# EAGLE design CNC-Controller (EAGLE 6.1)
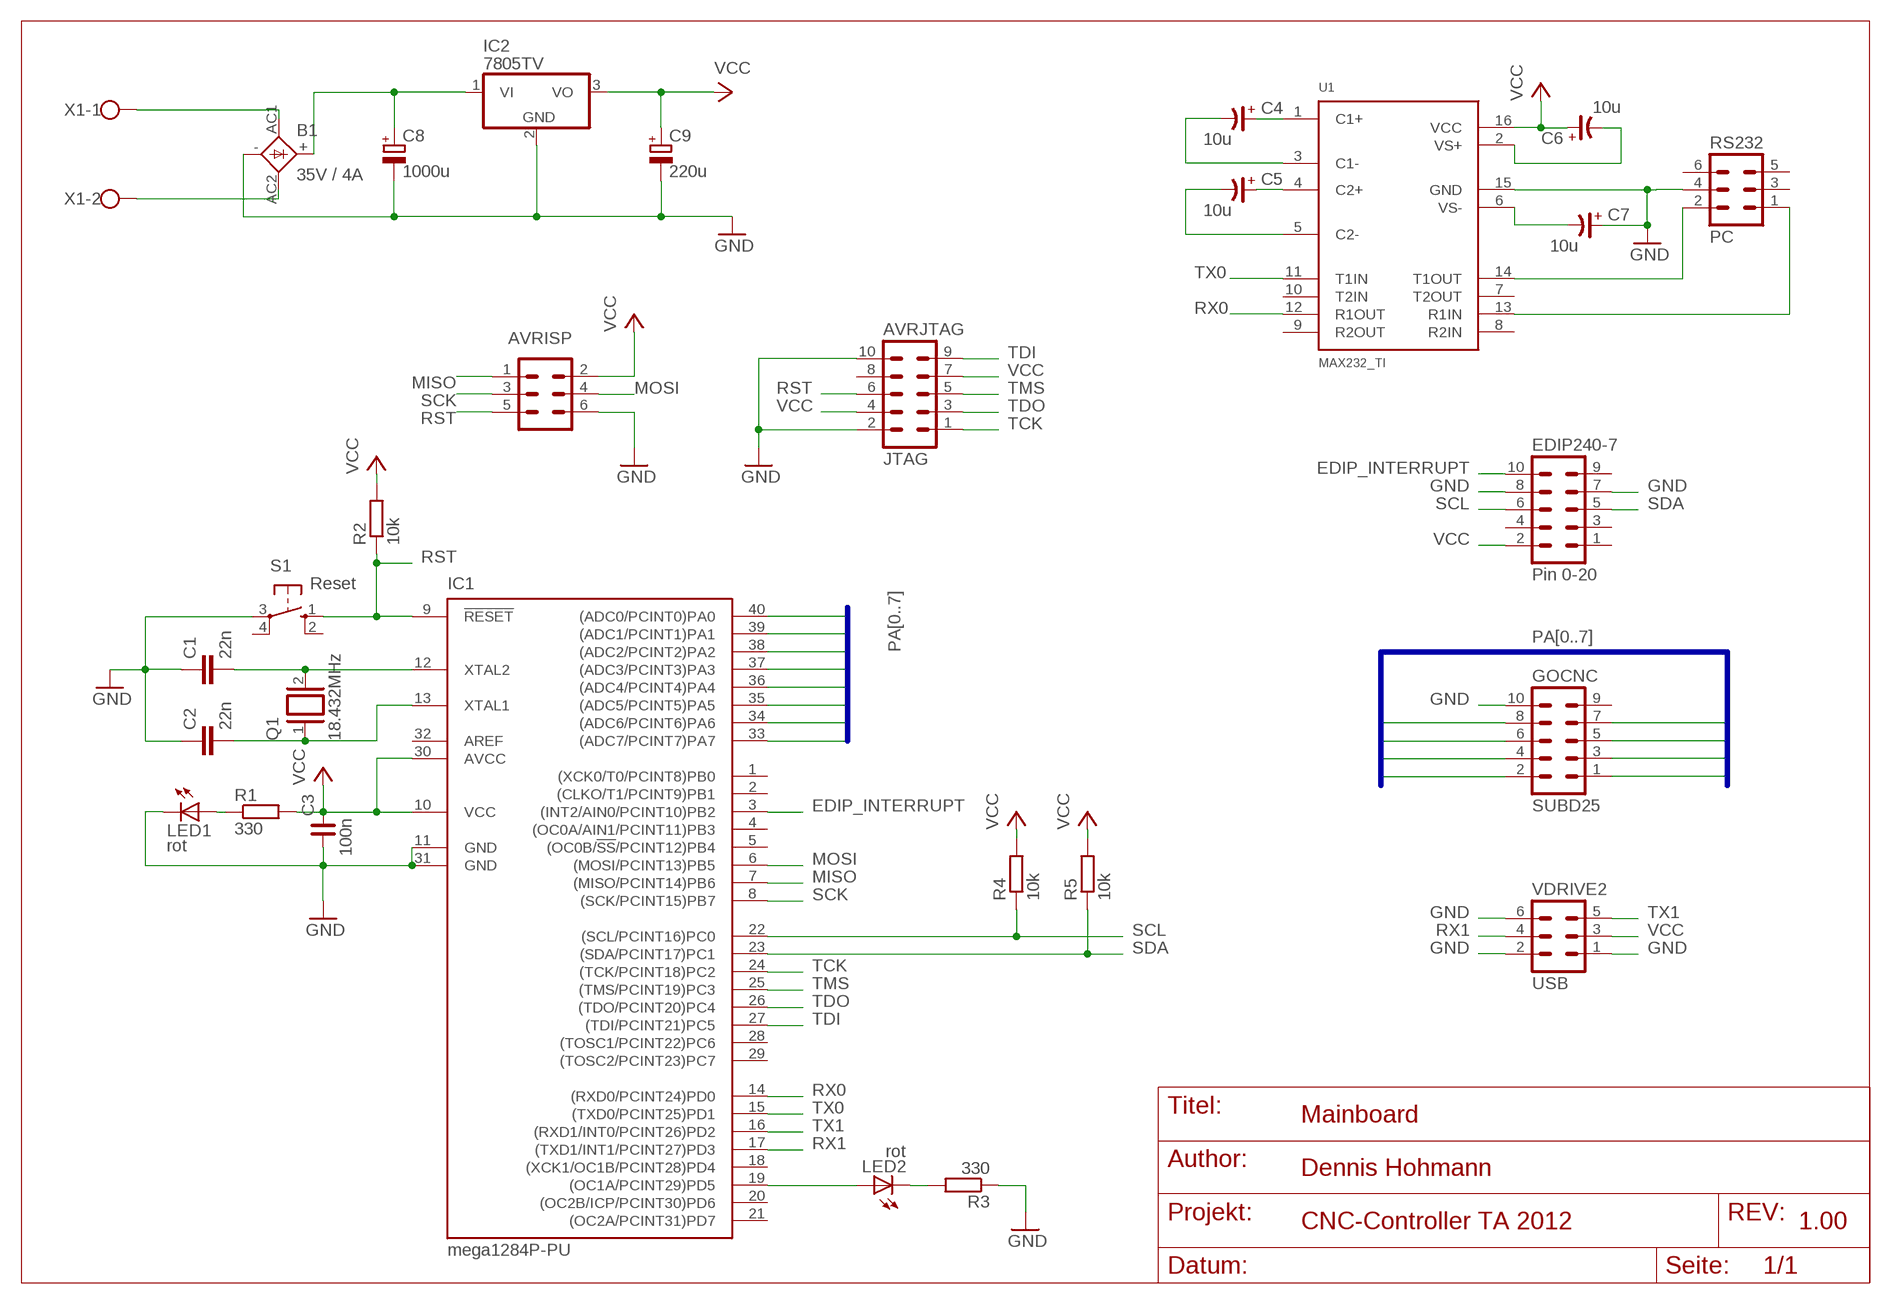
[diagram p0: schematic, sheet 1]

## Parts
AVRISP  ISP  ML6  [ML6]
AVRJTAG  JTAG  ML10  [ML10]
B1  35V / 4A  KBU  [KBU]
C1  22n  C-EU025-025X050  [C025-025X050]
C2  22n  C-EU025-025X050  [C025-025X050]
C3  100n  C_C025-050X025  [C025-050X025]
C4  10u  CP_TT025-050  [CTT-025-050]
C5  10u  CP_TT025-050  [CTT-025-050]
C6  10u  CP_TT025-050  [CTT-025-050]
C7  10u  CP_TT025-050  [CTT-025-050]
C8  1000u  CPOL-EUE5-13  [E5-13]
C9  220u  CPOL-EUE2-5  [E2-5]
EDIP240-7  Pin 0-20  ML10  [ML10]
GOCNC  SUBD25  ML10  [ML10]
IC1  mega1284P-PU  MEGA164P/324P/644P-PU  [DIL40]
IC2  7805TV  [TO220V]
LED1  rot  LED3MM  [LED3MM]
LED2  rot  LED3MM  [LED3MM]
Q1  18.432MHz  XTAL/S  [QS]
R1  330  R-EU_0207/10  [0207/10]
R2  10k  R-EU_0207/10  [0207/10]
R3  330  R-EU_0207/10  [0207/10]
R4  10k  R-EU_0207/10  [0207/10]
R5  10k  R-EU_0207/10  [0207/10]
RS232  PC  ML6  [ML6]
S1  Reset  10-XX  [B3F-10XX]
U1  MAX232_TI  [DIL16]
VDRIVE2  USB  ML6  [ML6]
X1  W237-102  [W237-102]

## Nets
EDIP_INTERRUPT: EDIP240-7.10 IC1.3((INT2/AIN0/PCINT10)PB2)
GND: AVRISP.6 AVRJTAG.2 AVRJTAG.10 B1.- C1.1 C2.1 C3.1 C7.+ C8.- C9.- EDIP240-7.7 EDIP240-7.8 GOCNC.10 IC1.11(GND) IC1.31(GND) IC2.2(GND) LED1.K(C) R3.1 RS232.4 S1.3(P) U1.15(GND) VDRIVE2.1 VDRIVE2.2 VDRIVE2.6
MISO: AVRISP.1 IC1.7((MISO/PCINT14)PB6)
MOSI: AVRISP.4 IC1.6((MOSI/PCINT13)PB5)
N$1: C1.2 IC1.12(XTAL2) Q1.2
N$2: C4.+ U1.1(C1+)
N$3: LED1.A R1.1
N$4: C4.- U1.3(C1-)
N$5: C2.2 IC1.13(XTAL1) Q1.1
N$6: C5.+ U1.4(C2+)
N$7: C5.- U1.5(C2-)
N$8: C6.- U1.2(VS+)
N$10: RS232.2 U1.14(T1OUT)
N$11: RS232.1 U1.13(R1IN)
N$12: C7.- U1.6(VS-)
N$13: IC1.19((OC1A/PCINT29)PD5) LED2.A
N$16: LED2.K(C) R3.2
PA0: GOCNC.1 IC1.40((ADC0/PCINT0)PA0)
PA1: GOCNC.2 IC1.39((ADC1/PCINT1)PA1)
PA2: GOCNC.3 IC1.38((ADC2/PCINT2)PA2)
PA3: GOCNC.4 IC1.37((ADC3/PCINT3)PA3)
PA4: GOCNC.5 IC1.36((ADC4/PCINT4)PA4)
PA5: GOCNC.6 IC1.35((ADC5/PCINT5)PA5)
PA6: GOCNC.7 IC1.34((ADC6/PCINT6)PA6)
PA7: GOCNC.8 IC1.33((ADC7/PCINT7)PA7)
RST: AVRISP.5 AVRJTAG.6 IC1.9(!RESET) R2.1 S1.1(S)
RX0: IC1.14((RXD0/PCINT24)PD0) U1.12(R1OUT)
RX1: IC1.17((TXD1/INT1/PCINT27)PD3) VDRIVE2.4
SCK: AVRISP.3 IC1.8((SCK/PCINT15)PB7)
SCL: EDIP240-7.6 IC1.22((SCL/PCINT16)PC0) R4.1
SDA: EDIP240-7.5 IC1.23((SDA/PCINT17)PC1) R5.1
TCK: AVRJTAG.1 IC1.24((TCK/PCINT18)PC2)
TDI: AVRJTAG.9 IC1.27((TDI/PCINT21)PC5)
TDO: AVRJTAG.3 IC1.26((TDO/PCINT20)PC4)
TMS: AVRJTAG.5 IC1.25((TMS/PCINT19)PC3)
TX0: IC1.15((TXD0/PCINT25)PD1) U1.11(T1IN)
TX1: IC1.16((RXD1/INT0/PCINT26)PD2) VDRIVE2.5
U+ [Leistung]: B1.+ C8.+ IC2.1(VI)
UB+ [Leistung]: B1.AC1 X1.1
UB- [Leistung]: B1.AC2 X1.2
VCC: AVRISP.2 AVRJTAG.4 AVRJTAG.7 C3.2 C6.+ C9.+ EDIP240-7.2 IC1.10(VCC) IC1.30(AVCC) IC2.3(VO) R1.2 R2.2 R4.2 R5.2 U1.16(VCC) VDRIVE2.3
Unconnected: AVRJTAG.8 EDIP240-7.1 EDIP240-7.3 EDIP240-7.4 EDIP240-7.9 GOCNC.9 IC1.1((XCK0/T0/PCINT8)PB0) IC1.2((CLKO/T1/PCINT9)PB1) IC1.4((OC0A/AIN1/PCINT11)PB3) IC1.5((OC0B/!SS!/PCINT12)PB4) IC1.18((XCK1/OC1B/PCINT28)PD4) IC1.20((OC2B/ICP/PCINT30)PD6) IC1.21((OC2A/PCINT31)PD7) IC1.28((TOSC1/PCINT22)PC6) IC1.29((TOSC2/PCINT23)PC7) RS232.3 RS232.5 RS232.6 S1.2(S1) S1.4(P1) U1.7(T2OUT) U1.8(R2IN) U1.9(R2OUT) U1.10(T2IN)

## Buses
PA[0..7]

## Notes on the sheet
- Mainboard
- Dennis Hohmann
- CNC-Controller TA 2012 | 1.00

## Power pins joined to a net without a drawn wire
AREF: IC1.32(AREF)

## Library data of the parts
AVRISP RS232 VDRIVE2 = con-harting-ml:ML6: HARTING
AVRJTAG EDIP240-7 GOCNC = con-harting-ml:ML10: HARTING
B1 = rectifier:KBU: DIOTEC RECTIFIER
C1 C2 = rcl:C-EU: CAPACITOR, European symbol
C3 = rc-master:C_: NON-POLARIZED CAP
C4-C7 = rc-master:CP_: POLARIZED CAP
C8 C9 = rcl:CPOL-EU: POLARIZED CAPACITOR, European symbol
IC1 = avr-5:MEGA164P/324P/644P-PU
IC2 = linear:78*: Positive VOLTAGE REGULATOR Source: http://cache.national.com/ds/LM/LM78L05.pdf http://www.fairchildsemi.com/ds/LM/LM7805.pdf
LED1 LED2 = led:LED: LED OSRAM: - CHIPLED LG R971, LG N971, LY N971, LG Q971, LY Q971, LO R971, LY R971 LH N974, LH R974 LS Q976, LO Q976, LY Q976 LO Q996 - Hyper CHIPLED LW Q18S LB Q993, LB Q99A, LB R99A - SideLED LS A670, LO A670, LY A670, LG A670, LP A670 LB A673, LV A673, LT A673, LW A673 LH A674 LY A675 LS A676, LA A676, LO A676, LY A676, LW A676 LS A679, LY A679, LG A679 - Hyper Micro SIDELED® LS Y876, LA Y876, LO Y876, LY Y876 LT Y87S - SmartLED LW L88C, LW L88S LB L89C, LB L89S, LG L890 LS L89K, LO L89K, LY L89K LS L896, LA L896, LO L896, LY L896 - TOPLED LS T670, LO T670, LY T670, LG T670, LP T670 LSG T670, LSP T670, LSY T670, LOP T670, LYG T670 LG T671, LOG T671, LSG T671 LB T673, LV T673, LT T673, LW T673 LH T674 LS T676, LA T676, LO T676, LY T676, LB T676, LH T676, LSB T676, LW T676 LB T67C, LV T67C, LT T67C, LS T67K, LO T67K, LY T67K, LW E67C LS E67B, LA E67B, LO E67B, LY E67B, LB E67C, LV E67C, LT E67C LW T67C LS T679, LY T679, LG T679 LS T770, LO T770, LY T770, LG T770, LP T770 LB T773, LV T773, LT T773, LW T773 LH T774 LS E675, LA E675, LY E675, LS T675 LS T776, LA T776, LO T776, LY T776, LB T776 LHGB T686 LT T68C, LB T68C - Hyper Mini TOPLED® LB M676 - Mini TOPLED Santana® LG M470 LS M47K, LO M47K, LY M47K Source: http://www.osram.convergy.de LUXEON: - LUMILED® LXK2-PW12-R00, LXK2-PW12-S00, LXK2-PW14-U00, LXK2-PW14-V00 LXK2-PM12-R00, LXK2-PM12-S00, LXK2-PM14-U00 LXK2-PE12-Q00, LXK2-PE12-R00, LXK2-PE12-S00, LXK2-PE14-T00, LXK2-PE14-U00 LXK2-PB12-K00, LXK2-PB12-L00, LXK2-PB12-M00, LXK2-PB14-N00, LXK2-PB14-P00, LXK2-PB14-Q00 LXK2-PR12-L00, LXK2-PR12-M00, LXK2-PR14-Q00, LXK2-PR14-R00 LXK2-PD12-Q00, LXK2-PD12-R00, LXK2-PD12-S00 LXK2-PH12-R00, LXK2-PH12-S00 LXK2-PL12-P00, LXK2-PL12-Q00, LXK2-PL12-R00 Source: www.luxeon.com KINGBRIGHT: KA-3528ASYC Source: www.kingbright.com
Q1 = special:XTAL/S: CRYSTAL
R1-R5 = resistor:R-EU_: RESISTOR, European symbol
S1 = switch-omron:10-XX: OMRON SWITCH
U1 = max232ti:MAX232_TI: MAX232, Texas Instruments Version
X1 = con-wago-500:W237-102: WAGO SCREW CLAMP; MPN: 237-102; OC_FARNELL: unknown; OC_NEWARK: 70K9898

## Net classes
1 Leistung: width 0.254 mm, clearance 0.305 mm

## Board
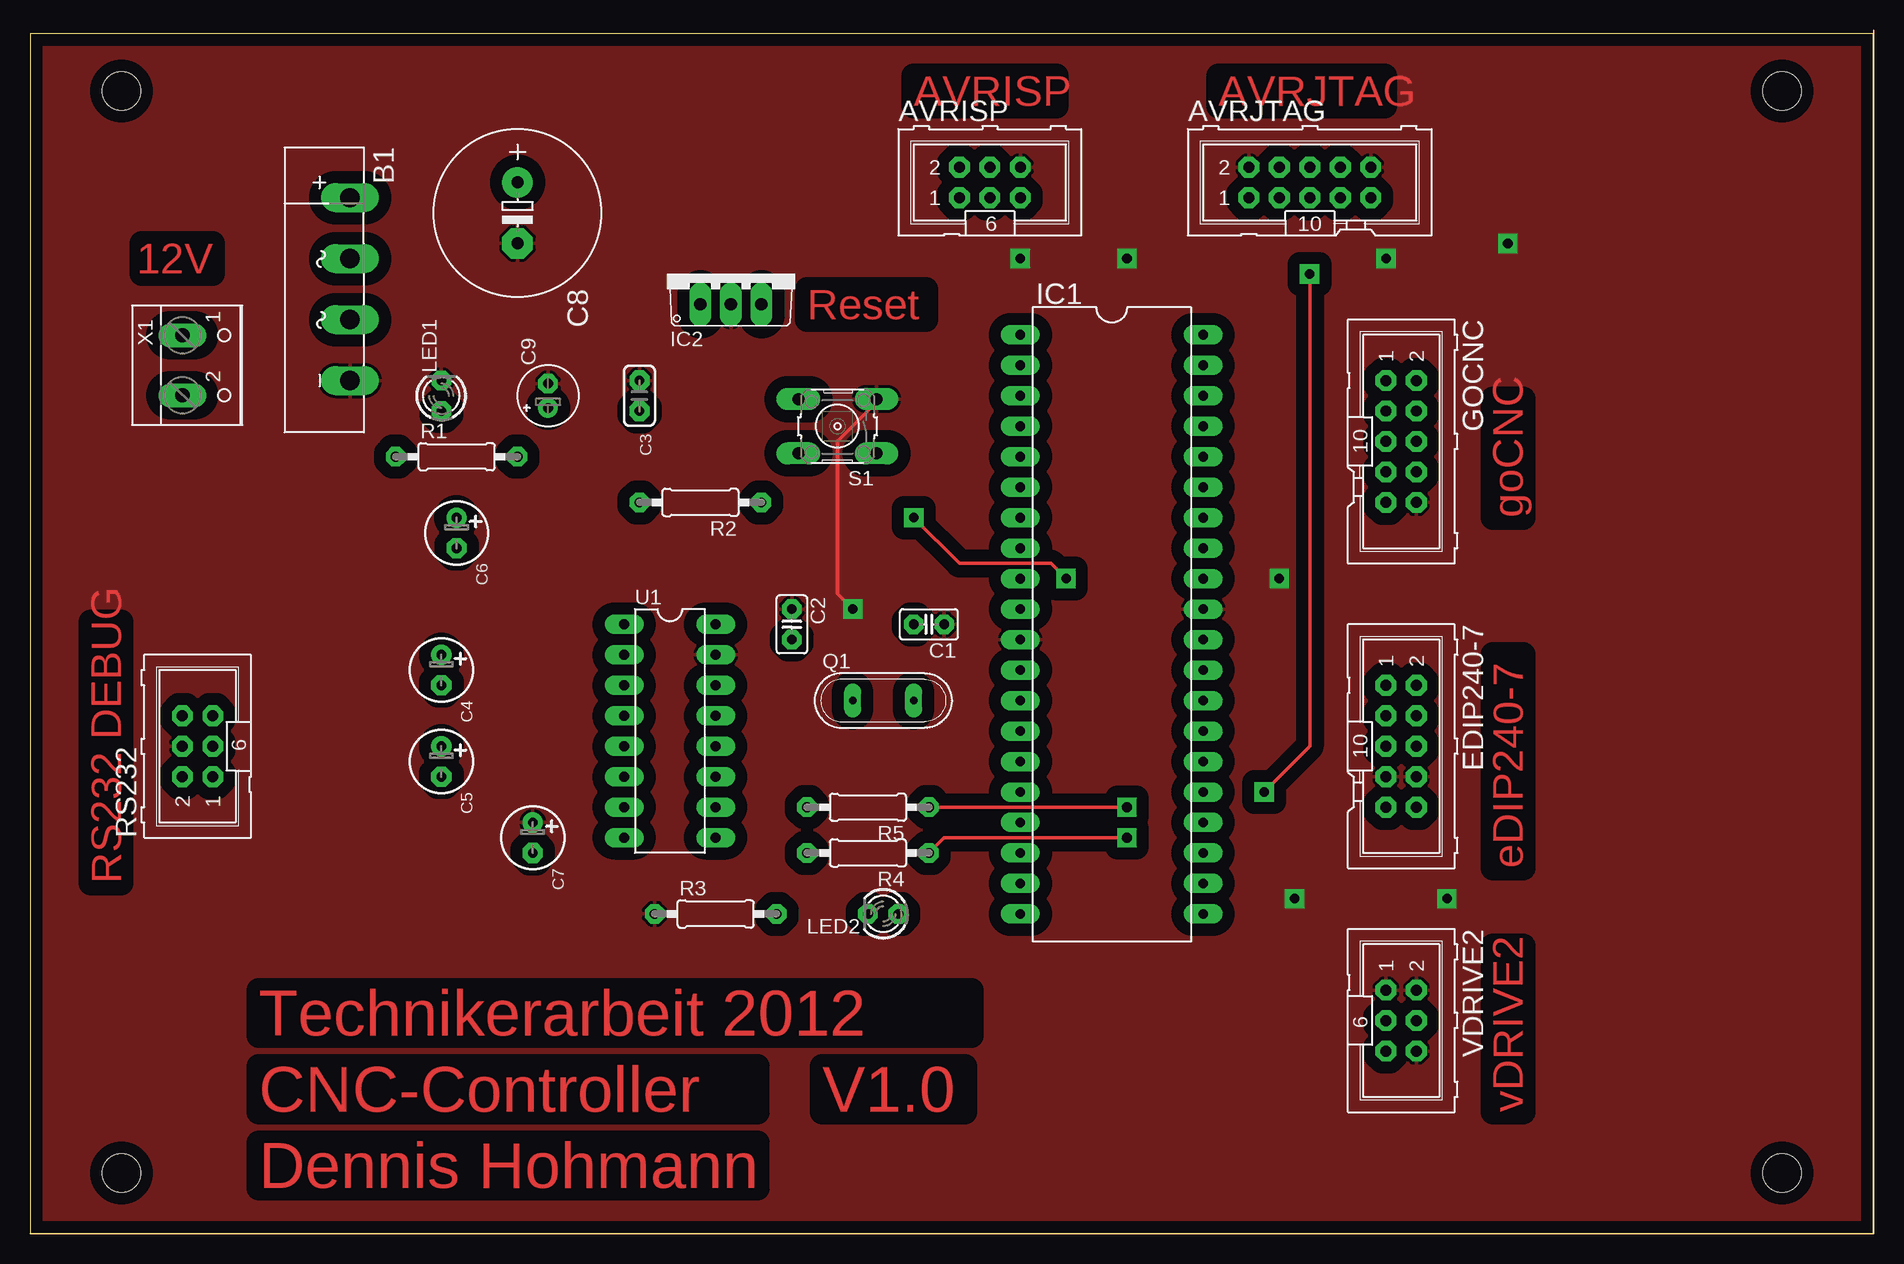
[diagram p1: board, top side]
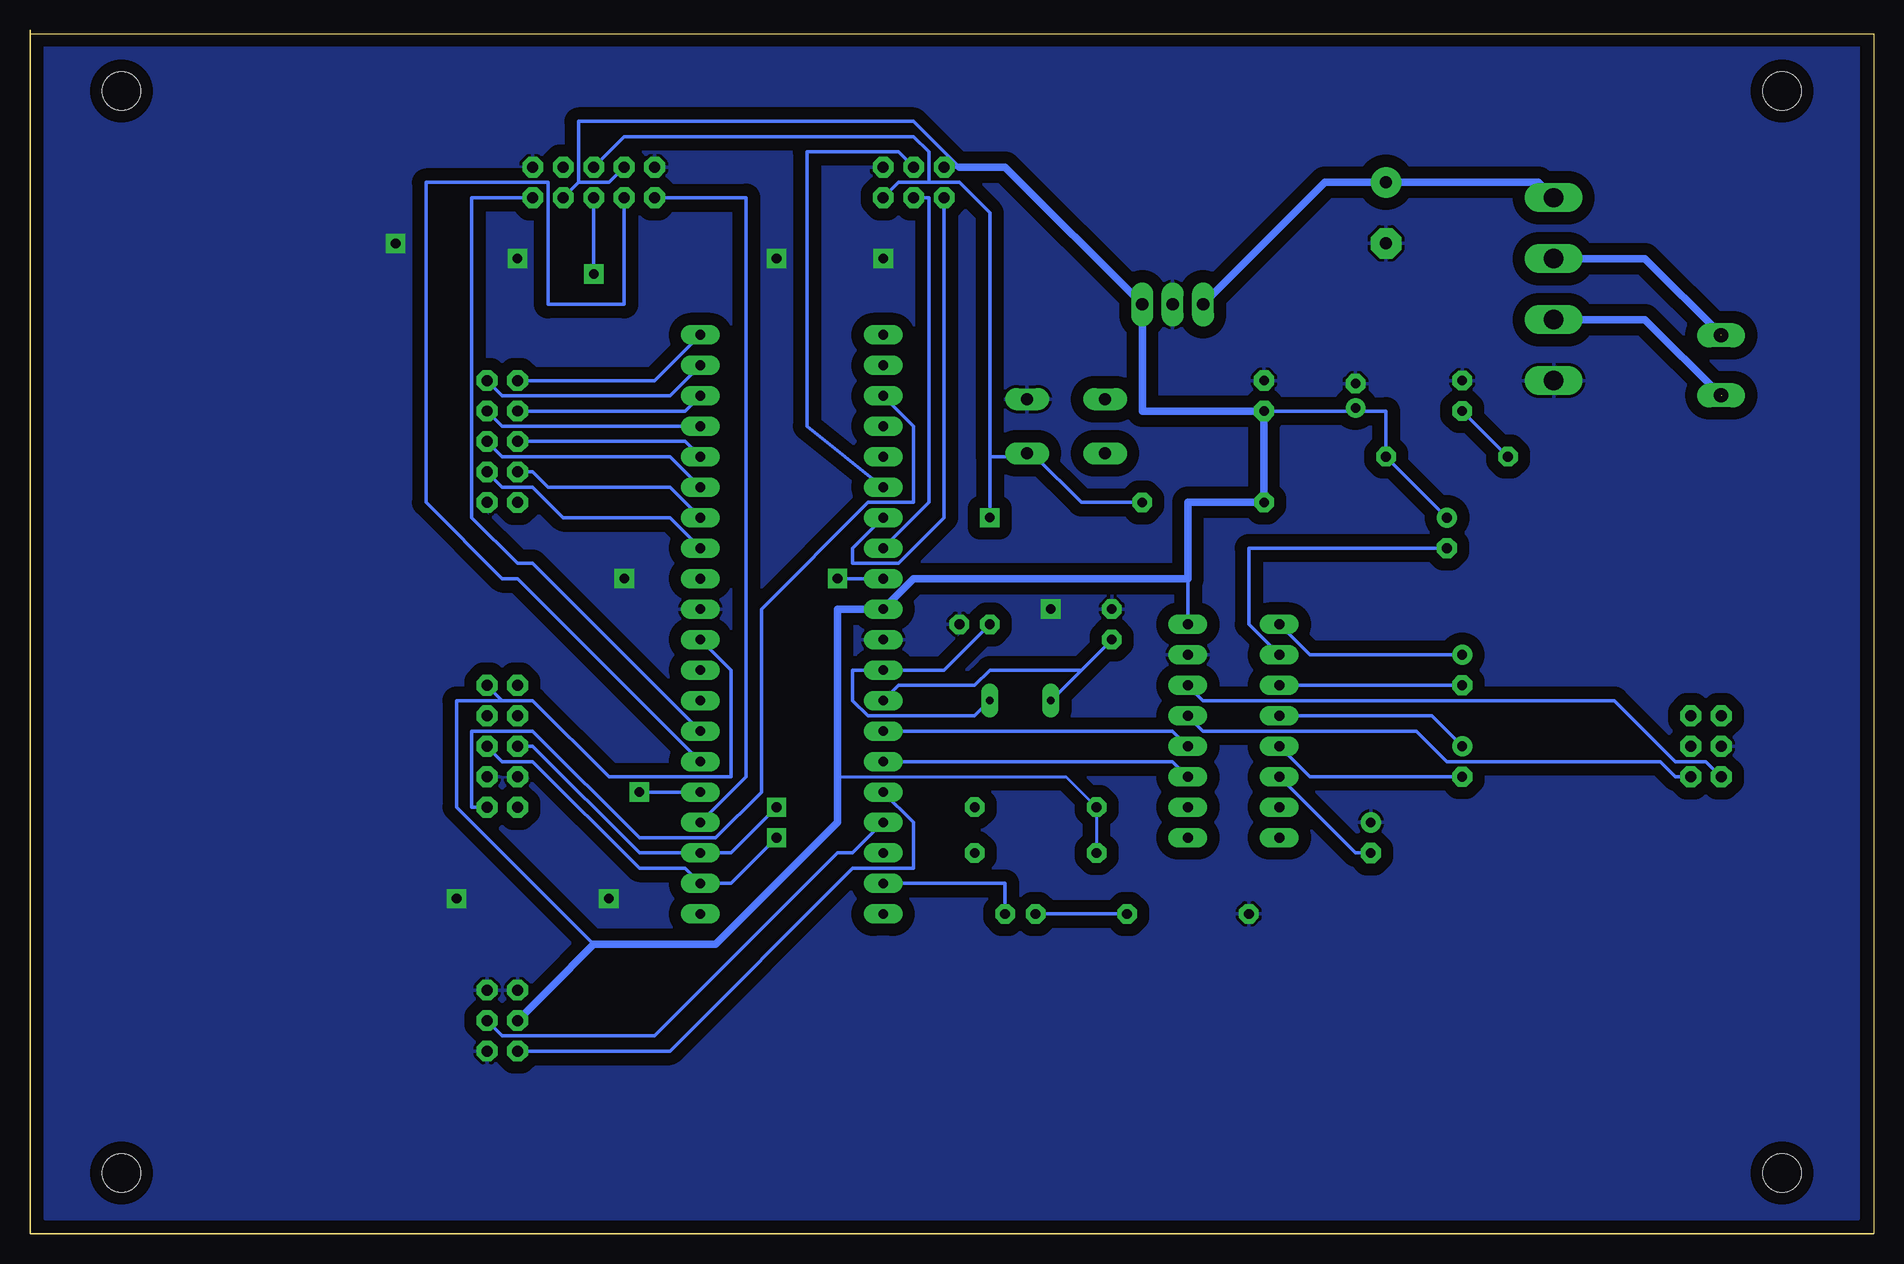
[diagram p2: board, bottom side, seen from below]

Size 153.65 x 100 mm. Coordinates in mm from the lower left corner, seen from the top.
Outline: 0,0 153.65,0 153.65,100 0,100 0,0
Copper layers (1*16): Top 0.035mm / dielectric 1.5mm / Bottom 0.035mm
Design rules: minimum track width 10mil, minimum drill 24mil, track to track 8mil, track to pad 8mil, pad to pad 8mil, via to via 8mil, smd to smd 8mil, copper to edge 40mil, drill to drill 8mil, minimum pad ring 16mil, minimum via ring 16mil, stop-mask expansion 4mil, vias tented up to drill 0mil, thermal gap 10mil
Holes 3.2 mm at 7.62,5.08 7.62,95.25 146.05,5.08 146.05,95.25

### Footprints (pad centres in the part's own frame; a part is rotated, then mirrored left to right if it is on the bottom)
ML6 = drill 0.914 octagon: 1 -2.54,-1.27; 2 -2.54,1.27; 3 0,-1.27; 4 0,1.27; 5 2.54,-1.27; 6 2.54,1.27
ML10 = drill 0.914 octagon: 1 -5.08,-1.27; 2 -5.08,1.27; 3 -2.54,-1.27; 4 -2.54,1.27; 5 0,-1.27; 6 0,1.27; 7 2.54,-1.27; 8 2.54,1.27; 9 5.08,-1.27; 10 5.08,1.27
KBU = drill 1.6 long: + -7.62,2.54; - 7.62,2.54; AC1 -2.54,2.54; AC2 2.54,2.54
C025-025X050 = drill 0.813 octagon: 1 -1.27,0; 2 1.27,0
C025-050X025 = drill 0.813 pad 1.676 octagon: 1 -1.27,0; 2 1.27,0
CTT-025-050 = drill 0.813 pad 1.676: + -1.27,0 | drill 0.813 pad 1.676 octagon: - 1.27,0
E5-13 = drill 1.016 pad 2.54: + -2.54,0 | drill 1.016 pad 2.54 octagon: - 2.54,0
E2-5 = drill 0.813 pad 1.27: + -1.016,0 | drill 0.813 pad 1.27 octagon: - 1.016,0
DIL40 = drill 0.813 long: 1 -24.13,-7.62; 2 -21.59,-7.62; 3 -19.05,-7.62; 4 -16.51,-7.62; 5 -13.97,-7.62; 6 -11.43,-7.62; 7 -8.89,-7.62; 8 -6.35,-7.62; 9 -3.81,-7.62; 10 -1.27,-7.62; 11 1.27,-7.62; 12 3.81,-7.62; 13 6.35,-7.62; 14 8.89,-7.62; 15 11.43,-7.62; 16 13.97,-7.62; 17 16.51,-7.62; 18 19.05,-7.62; 19 21.59,-7.62; 20 24.13,-7.62; 21 24.13,7.62; 22 21.59,7.62; 23 19.05,7.62; 24 16.51,7.62; 25 13.97,7.62; 26 11.43,7.62; 27 8.89,7.62; 28 6.35,7.62; 29 3.81,7.62; 30 1.27,7.62; 31 -1.27,7.62; 32 -3.81,7.62; 33 -6.35,7.62; 34 -8.89,7.62; 35 -11.43,7.62; 36 -13.97,7.62; 37 -16.51,7.62; 38 -19.05,7.62; 39 -21.59,7.62; 40 -24.13,7.62
TO220V = drill 1.016 long: 1 -2.54,-2.54; 2 0,-2.54; 3 2.54,-2.54
LED3MM = drill 0.813 octagon: A -1.27,0; K 1.27,0
QS = drill 0.61 long: 1 -2.54,0; 2 2.54,0
0207/10 = drill 0.813 octagon: 1 -5.08,0; 2 5.08,0
B3F-10XX = drill 1.016 long: 1 -3.251,2.261; 2 3.251,2.261; 3 -3.251,-2.261; 4 3.251,-2.261
DIL16 = drill 0.813 long: 1 -8.89,-3.81; 2 -6.35,-3.81; 3 -3.81,-3.81; 4 -1.27,-3.81; 5 1.27,-3.81; 6 3.81,-3.81; 7 6.35,-3.81; 8 8.89,-3.81; 9 8.89,3.81; 10 6.35,3.81; 11 3.81,3.81; 12 1.27,3.81; 13 -1.27,3.81; 14 -3.81,3.81; 15 -6.35,3.81; 16 -8.89,3.81
W237-102 = drill 1.194 long: 1 -2.5,-1.27; 2 2.5,-1.27

### Placement (x,y rotation side)
AVRISP  80.01,87.63 0 top
AVRJTAG  106.68,87.63 0 top
B1  24.13,78.74 270 top
C1  74.93,50.8 180 top
C2  63.5,50.8 270 top
C3  50.8,69.85 270 top
C4  34.29,46.99 270 top
C5  34.29,39.37 270 top
C6  35.56,58.42 270 top
C7  41.91,33.02 270 top
C8  40.64,85.09 270 top
C9  43.18,69.85 90 top
EDIP240-7  114.3,40.64 270 top
GOCNC  114.3,66.04 270 top
IC1  90.17,50.8 270 top
IC2  58.42,80.01 0 top
LED1  34.29,69.85 90 top
LED2  71.12,26.67 180 top
Q1  71.12,44.45 0 top
R1  35.56,64.77 0 top
R2  55.88,60.96 180 top
R3  57.15,26.67 0 top
R4  69.85,31.75 180 top
R5  69.85,35.56 180 top
RS232  13.97,40.64 90 top
S1  67.31,67.31 180 top
U1  53.34,41.91 270 top
VDRIVE2  114.3,17.78 270 top
X1  13.97,72.39 270 top

### Tracks (layer width: path | path; a pad name or v marks a point on that pad's centre or on a via)
EDIP_INTERRUPT
  Bottom 0.305: IC1.3 80.01,67.31 80.01,60.96 83.82,60.96 92.71,52.07 92.71,36.83 96.52,33.02 102.87,33.02 111.76,41.91 116.84,41.91 116.84,35.56 EDIP240-7.10
GND  (via drill 0.8)
  Top 0.305: S1.3 70.56,69.29 67.31,66.04 67.31,58.42 67.31,53.34 v68.58,52.07
  other vias: 104.14,54.61 82.55,81.28 113.03,81.28 123.19,82.55 91.44,81.28 105.41,27.94 118.11,27.94
  pour Bottom (isolate 1.016): 1.27,99.06 152.4,99.06 152.4,1.27 1.27,1.27
  pour Top (isolate 1.016): 0,100.33 153.67,100.33 153.67,0 0,0
MISO
  Bottom 0.305: IC1.7 85.09,57.15 85.09,55.88 81.28,55.88 77.47,59.69 AVRISP.1
MOSI
  Bottom 0.305: IC1.6 88.9,67.31 88.9,90.17 81.28,90.17 AVRISP.4
N$1
  Bottom 0.305: Q1.2 74.93,43.18 83.82,43.18 85.09,44.45 85.09,46.99 IC1.12 77.47,46.99 C1.2
N$2
  Bottom 0.305: U1.1 46.99,48.26 C4.+
N$3
  Bottom 0.305: LED1.A R1.1
N$4
  Bottom 0.305: C4.- U1.3
N$5
  Bottom 0.305: C2.2 66.04,46.99 | 66.04,46.99 Q1.1 | IC1.13 81.28,45.72 74.93,45.72 73.66,46.99 66.04,46.99
N$6
  Bottom 0.305: U1.4 36.83,43.18 C5.+
N$7
  Bottom 0.305: U1.5 46.99,38.1 C5.-
N$8
  Bottom 0.305: U1.2 52.07,50.8 52.07,57.15 C6.-
N$10
  Bottom 0.305: U1.14 55.88,44.45 21.59,44.45 16.51,39.37 13.97,39.37 RS232.2
N$11
  Bottom 0.305: U1.13 55.88,41.91 38.1,41.91 35.56,39.37 17.78,39.37 16.51,38.1 RS232.1
N$12
  Bottom 0.305: U1.6 43.18,31.75 C7.-
N$13
  Bottom 0.305: LED2.A 72.39,29.21 IC1.19
N$16
  Bottom 0.305: LED2.K R3.2
N$19
  Top 0.305: 6.35,5.08 8.89,5.08
N$20
  Top 0.305: 7.62,3.81 7.62,6.35
N$21
  Bottom 0.305: 6.35,5.08 8.89,5.08
N$22
  Bottom 0.305: 7.62,6.35 7.62,3.81
N$23
  Bottom 0.305: 146.05,96.52 146.05,93.98
N$24
  Bottom 0.305: 144.78,95.25 147.32,95.25
N$25
  Top 0.305: 146.05,96.52 146.05,93.98
N$26
  Top 0.305: 144.78,95.25 147.32,95.25
PA0
  Bottom 0.305: IC1.40 101.6,71.12 GOCNC.1
PA1
  Bottom 0.305: IC1.39 100.33,69.85 114.3,69.85 GOCNC.2
PA2
  Bottom 0.305: IC1.38 99.06,68.58 GOCNC.3
PA3
  Bottom 0.305: IC1.37 114.3,67.31 GOCNC.4
PA4
  Bottom 0.305: IC1.36 99.06,66.04 GOCNC.5
PA5
  Bottom 0.305: IC1.35 100.33,64.77 114.3,64.77 GOCNC.6
PA6
  Bottom 0.305: IC1.34 100.33,62.23 110.49,62.23 111.76,63.5 GOCNC.7
PA7
  Bottom 0.305: IC1.33 100.33,59.69 109.22,59.69 111.76,62.23 114.3,62.23 GOCNC.8
RST  (via drill 0.8)
  Top 0.305: v73.66,59.69 77.47,55.88 85.09,55.88 v86.36,54.61
  Bottom 0.305: R2.1 66.04,60.96 69.85,64.77 S1.1 71.12,64.77 73.66,64.77 | AVRISP.5 81.28,87.63 78.74,87.63 | 78.74,87.63 76.2,87.63 73.66,85.09 73.66,64.77 | AVRJTAG.6 104.14,91.44 80.01,91.44 78.74,90.17 78.74,87.63 | IC1.9 v86.36,54.61 | 73.66,64.77 v73.66,59.69
RX0
  Bottom 0.305: U1.12 58.42,41.91 IC1.14
RX1
  Bottom 0.305: IC1.17 85.09,31.75 86.36,31.75 101.6,16.51 114.3,16.51 VDRIVE2.4
SCK
  Bottom 0.305: IC1.8 78.74,60.96 78.74,86.36 AVRISP.3
SCL  (via drill 0.8)
  Top 0.305: v91.44,33.02 76.2,33.02 R4.1
  Bottom 0.305: EDIP240-7.6 114.3,39.37 111.76,39.37 102.87,30.48 99.06,30.48 IC1.22 95.25,29.21 v91.44,33.02
SDA  (via drill 0.8)
  Top 0.305: R5.1 v91.44,35.56
  Bottom 0.305: EDIP240-7.5 111.76,40.64 102.87,31.75 IC1.23 95.25,31.75 v91.44,35.56
TCK
  Bottom 0.305: IC1.24 93.98,38.1 93.98,86.36 AVRJTAG.1
TDI
  Bottom 0.305: AVRJTAG.9 116.84,86.36 116.84,59.69 113.03,55.88 111.76,55.88 IC1.27
TDO
  Bottom 0.305: IC1.26 113.03,54.61 114.3,54.61 120.65,60.96 120.65,87.63 110.49,87.63 110.49,77.47 104.14,77.47 AVRJTAG.3
TMS  (via drill 0.8)
  Top 0.305: v106.68,80.01 106.68,40.64 v102.87,36.83
  Bottom 0.305: IC1.25 v102.87,36.83 | AVRJTAG.5 v106.68,80.01
TX0
  Bottom 0.305: U1.11 58.42,39.37 IC1.15
TX1
  Bottom 0.305: IC1.16 80.01,34.29 80.01,30.48 85.09,30.48 100.33,15.24 VDRIVE2.5
U+
  Bottom 0.61: IC2.1 45.72,87.63 C8.+ 27.94,87.63 B1.+
UB+  (1 unrouted)
  Bottom 0.61: 12.7,74.93 19.05,81.28 B1.AC1
UB-  (1 unrouted)
  Bottom 0.61: 12.7,69.85 19.05,76.2 B1.AC2
VCC
  Bottom 0.254: R4.2 R5.2 67.31,38.1 86.36,38.1
  Bottom 0.305: 107.95,87.63 AVRJTAG.7 | 107.95,87.63 105.41,87.63 AVRJTAG.4 | AVRISP.2 76.2,88.9 80.01,92.71 107.95,92.71 107.95,87.63 | IC1.30 95.25,46.99 95.25,38.1 105.41,38.1 111.76,44.45 114.3,44.45 | EDIP240-7.2 114.3,44.45 | 106.68,24.13 113.03,30.48 116.84,34.29 118.11,35.56 118.11,44.45 114.3,44.45 | 43.18,68.58 40.64,68.58 R1.2 C6.+ | 43.18,68.58 C9.+ 43.18,68.58 | 43.18,68.58 C3.2 | 57.15,54.61 U1.16
  Bottom 0.61: 76.2,88.9 72.39,88.9 IC2.3 60.96,68.58 C3.2 R2.2 57.15,60.96 57.15,54.61 80.01,54.61 IC1.10 86.36,52.07 86.36,38.1 86.36,34.29 96.52,24.13 106.68,24.13 110.49,20.32 VDRIVE2.3

### Text on the board
Top: AVRISP | AVRJTAG | 12V | Reset | goCNC | eDIP240-7 | RS232 DEBUG | Technikerarbeit 2012 | CNC-Controller | V1.0 | vDRIVE2 | Dennis Hohmann